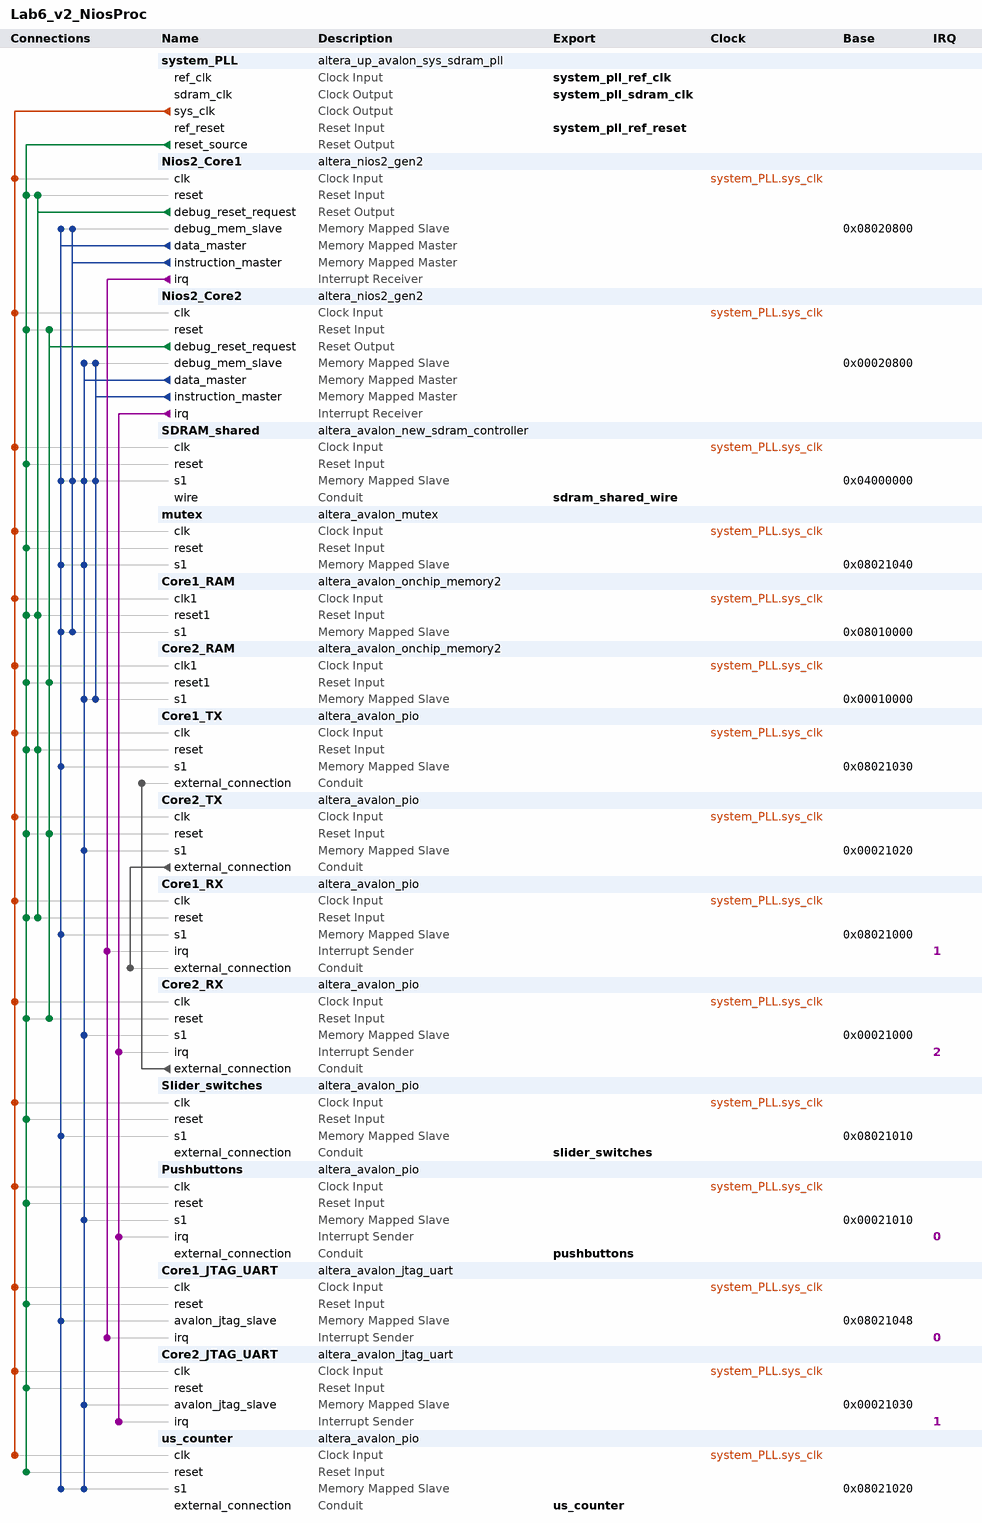
[diagram p0: system contents]
# Platform Designer (Qsys) system Lab6_v2_NiosProc, MAX 10 10M50DAF484C7G
# Parameters at their usual value, and those the tool derives, are not listed.
package require -exact qsys 18.1
create_system Lab6_v2_NiosProc
set_project_property DEVICE_FAMILY {MAX 10}
set_project_property DEVICE 10M50DAF484C7G

add_instance system_PLL altera_up_avalon_sys_sdram_pll 18.0
set_instance_parameter_value system_PLL CV_boards DE10-Standard
set_instance_parameter_value system_PLL gui_outclk 50.0
set_instance_parameter_value system_PLL gui_refclk 50.0

add_instance Nios2_Core1 altera_nios2_gen2 18.1
set_instance_parameter_value Nios2_Core1 dcache_size 2048
set_instance_parameter_value Nios2_Core1 exceptionSlave Core1_RAM.s1
set_instance_parameter_value Nios2_Core1 icache_size 4096
set_instance_parameter_value Nios2_Core1 impl Fast
set_instance_parameter_value Nios2_Core1 io_regionbase 134352896
set_instance_parameter_value Nios2_Core1 io_regionsize 4096
set_instance_parameter_value Nios2_Core1 resetSlave Core1_RAM.s1

add_instance Nios2_Core2 altera_nios2_gen2 18.1
set_instance_parameter_value Nios2_Core2 cpuID 1
set_instance_parameter_value Nios2_Core2 dcache_size 2048
set_instance_parameter_value Nios2_Core2 exceptionSlave Core2_RAM.s1
set_instance_parameter_value Nios2_Core2 icache_size 4096
set_instance_parameter_value Nios2_Core2 impl Fast
set_instance_parameter_value Nios2_Core2 io_regionbase 135168
set_instance_parameter_value Nios2_Core2 io_regionsize 4096
set_instance_parameter_value Nios2_Core2 resetSlave Core2_RAM.s1

add_instance SDRAM_shared altera_avalon_new_sdram_controller 18.1
set_instance_parameter_value SDRAM_shared TAC 5.5
set_instance_parameter_value SDRAM_shared TRCD 20.0
set_instance_parameter_value SDRAM_shared TRP 20.0
set_instance_parameter_value SDRAM_shared casLatency 3
set_instance_parameter_value SDRAM_shared columnWidth 10
set_instance_parameter_value SDRAM_shared dataWidth 16
set_instance_parameter_value SDRAM_shared generateSimulationModel false
set_instance_parameter_value SDRAM_shared model single_Micron_MT48LC4M32B2_7_chip
set_instance_parameter_value SDRAM_shared numberOfBanks 4
set_instance_parameter_value SDRAM_shared numberOfChipSelects 1
set_instance_parameter_value SDRAM_shared powerUpDelay 100.0
set_instance_parameter_value SDRAM_shared refreshPeriod 15.625
set_instance_parameter_value SDRAM_shared rowWidth 13

add_instance mutex altera_avalon_mutex 18.1

add_instance Core1_RAM altera_avalon_onchip_memory2 18.1
set_instance_parameter_value Core1_RAM dataWidth 32
set_instance_parameter_value Core1_RAM dualPort false
set_instance_parameter_value Core1_RAM initMemContent true
set_instance_parameter_value Core1_RAM initializationFileName onchip_mem.hex
set_instance_parameter_value Core1_RAM memorySize 65536

add_instance Core2_RAM altera_avalon_onchip_memory2 18.1
set_instance_parameter_value Core2_RAM dataWidth 32
set_instance_parameter_value Core2_RAM dualPort false
set_instance_parameter_value Core2_RAM initMemContent true
set_instance_parameter_value Core2_RAM initializationFileName onchip_mem.hex
set_instance_parameter_value Core2_RAM memorySize 65536

add_instance Core1_TX altera_avalon_pio 18.1
set_instance_parameter_value Core1_TX direction Output
set_instance_parameter_value Core1_TX width 1

add_instance Core2_TX altera_avalon_pio 18.1
set_instance_parameter_value Core2_TX direction Output
set_instance_parameter_value Core2_TX width 1

add_instance Core1_RX altera_avalon_pio 18.1
set_instance_parameter_value Core1_RX captureEdge true
set_instance_parameter_value Core1_RX direction Input
set_instance_parameter_value Core1_RX generateIRQ true
set_instance_parameter_value Core1_RX irqType EDGE
set_instance_parameter_value Core1_RX width 1

add_instance Core2_RX altera_avalon_pio 18.1
set_instance_parameter_value Core2_RX captureEdge true
set_instance_parameter_value Core2_RX direction Input
set_instance_parameter_value Core2_RX generateIRQ true
set_instance_parameter_value Core2_RX irqType EDGE
set_instance_parameter_value Core2_RX width 1

add_instance Slider_switches altera_avalon_pio 18.1
set_instance_parameter_value Slider_switches direction Input
set_instance_parameter_value Slider_switches width 10

add_instance Pushbuttons altera_avalon_pio 18.1
set_instance_parameter_value Pushbuttons captureEdge true
set_instance_parameter_value Pushbuttons direction Input
set_instance_parameter_value Pushbuttons generateIRQ true
set_instance_parameter_value Pushbuttons irqType EDGE
set_instance_parameter_value Pushbuttons width 2

add_instance Core1_JTAG_UART altera_avalon_jtag_uart 18.1
set_instance_parameter_value Core1_JTAG_UART simInteractiveOptions NO_INTERACTIVE_WINDOWS

add_instance Core2_JTAG_UART altera_avalon_jtag_uart 18.1
set_instance_parameter_value Core2_JTAG_UART simInteractiveOptions NO_INTERACTIVE_WINDOWS

add_instance us_counter altera_avalon_pio 18.1
set_instance_parameter_value us_counter direction Input
set_instance_parameter_value us_counter width 32

# connections
add_connection system_PLL.sys_clk Core1_JTAG_UART.clk clock
add_connection system_PLL.sys_clk Core1_RAM.clk1 clock
add_connection system_PLL.sys_clk Core1_RX.clk clock
add_connection system_PLL.sys_clk Core1_TX.clk clock
add_connection system_PLL.sys_clk Core2_JTAG_UART.clk clock
add_connection system_PLL.sys_clk Core2_RAM.clk1 clock
add_connection system_PLL.sys_clk Core2_RX.clk clock
add_connection system_PLL.sys_clk Core2_TX.clk clock
add_connection system_PLL.sys_clk mutex.clk clock
add_connection system_PLL.sys_clk Nios2_Core1.clk clock
add_connection system_PLL.sys_clk Nios2_Core2.clk clock
add_connection system_PLL.sys_clk Pushbuttons.clk clock
add_connection system_PLL.sys_clk SDRAM_shared.clk clock
add_connection system_PLL.sys_clk Slider_switches.clk clock
add_connection system_PLL.sys_clk us_counter.clk clock
add_connection Nios2_Core1.debug_reset_request Core1_RAM.reset1 reset
add_connection Nios2_Core1.debug_reset_request Core1_RX.reset reset
add_connection Nios2_Core1.debug_reset_request Core1_TX.reset reset
add_connection Nios2_Core1.debug_reset_request Nios2_Core1.reset reset
add_connection Nios2_Core2.debug_reset_request Core2_RAM.reset1 reset
add_connection Nios2_Core2.debug_reset_request Core2_RX.reset reset
add_connection Nios2_Core2.debug_reset_request Core2_TX.reset reset
add_connection Nios2_Core2.debug_reset_request Nios2_Core2.reset reset
add_connection system_PLL.reset_source Core1_JTAG_UART.reset reset
add_connection system_PLL.reset_source Core1_RAM.reset1 reset
add_connection system_PLL.reset_source Core1_RX.reset reset
add_connection system_PLL.reset_source Core1_TX.reset reset
add_connection system_PLL.reset_source Core2_JTAG_UART.reset reset
add_connection system_PLL.reset_source Core2_RAM.reset1 reset
add_connection system_PLL.reset_source Core2_RX.reset reset
add_connection system_PLL.reset_source Core2_TX.reset reset
add_connection system_PLL.reset_source mutex.reset reset
add_connection system_PLL.reset_source Nios2_Core1.reset reset
add_connection system_PLL.reset_source Nios2_Core2.reset reset
add_connection system_PLL.reset_source Pushbuttons.reset reset
add_connection system_PLL.reset_source SDRAM_shared.reset reset
add_connection system_PLL.reset_source Slider_switches.reset reset
add_connection system_PLL.reset_source us_counter.reset reset
add_connection Nios2_Core1.data_master Core1_JTAG_UART.avalon_jtag_slave avalon
set_connection_parameter_value Nios2_Core1.data_master/Core1_JTAG_UART.avalon_jtag_slave baseAddress 0x08021048
add_connection Nios2_Core1.data_master Core1_RAM.s1 avalon
set_connection_parameter_value Nios2_Core1.data_master/Core1_RAM.s1 baseAddress 0x08010000
add_connection Nios2_Core1.data_master Core1_RX.s1 avalon
set_connection_parameter_value Nios2_Core1.data_master/Core1_RX.s1 baseAddress 0x08021000
add_connection Nios2_Core1.data_master Core1_TX.s1 avalon
set_connection_parameter_value Nios2_Core1.data_master/Core1_TX.s1 baseAddress 0x08021030
add_connection Nios2_Core1.data_master mutex.s1 avalon
set_connection_parameter_value Nios2_Core1.data_master/mutex.s1 baseAddress 0x08021040
add_connection Nios2_Core1.data_master Nios2_Core1.debug_mem_slave avalon
set_connection_parameter_value Nios2_Core1.data_master/Nios2_Core1.debug_mem_slave baseAddress 0x08020800
add_connection Nios2_Core1.data_master SDRAM_shared.s1 avalon
set_connection_parameter_value Nios2_Core1.data_master/SDRAM_shared.s1 baseAddress 0x04000000
add_connection Nios2_Core1.data_master Slider_switches.s1 avalon
set_connection_parameter_value Nios2_Core1.data_master/Slider_switches.s1 baseAddress 0x08021010
add_connection Nios2_Core1.data_master us_counter.s1 avalon
set_connection_parameter_value Nios2_Core1.data_master/us_counter.s1 baseAddress 0x08021020
add_connection Nios2_Core1.instruction_master Core1_RAM.s1 avalon
set_connection_parameter_value Nios2_Core1.instruction_master/Core1_RAM.s1 baseAddress 0x08010000
add_connection Nios2_Core1.instruction_master Nios2_Core1.debug_mem_slave avalon
set_connection_parameter_value Nios2_Core1.instruction_master/Nios2_Core1.debug_mem_slave baseAddress 0x08020800
add_connection Nios2_Core1.instruction_master SDRAM_shared.s1 avalon
set_connection_parameter_value Nios2_Core1.instruction_master/SDRAM_shared.s1 baseAddress 0x04000000
add_connection Nios2_Core2.data_master Core2_JTAG_UART.avalon_jtag_slave avalon
set_connection_parameter_value Nios2_Core2.data_master/Core2_JTAG_UART.avalon_jtag_slave baseAddress 0x00021030
add_connection Nios2_Core2.data_master Core2_RAM.s1 avalon
set_connection_parameter_value Nios2_Core2.data_master/Core2_RAM.s1 baseAddress 0x00010000
add_connection Nios2_Core2.data_master Core2_RX.s1 avalon
set_connection_parameter_value Nios2_Core2.data_master/Core2_RX.s1 baseAddress 0x00021000
add_connection Nios2_Core2.data_master Core2_TX.s1 avalon
set_connection_parameter_value Nios2_Core2.data_master/Core2_TX.s1 baseAddress 0x00021020
add_connection Nios2_Core2.data_master mutex.s1 avalon
set_connection_parameter_value Nios2_Core2.data_master/mutex.s1 baseAddress 0x08021040
add_connection Nios2_Core2.data_master Nios2_Core2.debug_mem_slave avalon
set_connection_parameter_value Nios2_Core2.data_master/Nios2_Core2.debug_mem_slave baseAddress 0x00020800
add_connection Nios2_Core2.data_master Pushbuttons.s1 avalon
set_connection_parameter_value Nios2_Core2.data_master/Pushbuttons.s1 baseAddress 0x00021010
add_connection Nios2_Core2.data_master SDRAM_shared.s1 avalon
set_connection_parameter_value Nios2_Core2.data_master/SDRAM_shared.s1 baseAddress 0x04000000
add_connection Nios2_Core2.data_master us_counter.s1 avalon
set_connection_parameter_value Nios2_Core2.data_master/us_counter.s1 baseAddress 0x08021020
add_connection Nios2_Core2.instruction_master Core2_RAM.s1 avalon
set_connection_parameter_value Nios2_Core2.instruction_master/Core2_RAM.s1 baseAddress 0x00010000
add_connection Nios2_Core2.instruction_master Nios2_Core2.debug_mem_slave avalon
set_connection_parameter_value Nios2_Core2.instruction_master/Nios2_Core2.debug_mem_slave baseAddress 0x00020800
add_connection Nios2_Core2.instruction_master SDRAM_shared.s1 avalon
set_connection_parameter_value Nios2_Core2.instruction_master/SDRAM_shared.s1 baseAddress 0x04000000
add_connection Core2_RX.external_connection Core1_TX.external_connection conduit
add_connection Core2_TX.external_connection Core1_RX.external_connection conduit
add_connection Nios2_Core1.irq Core1_JTAG_UART.irq interrupt
set_connection_parameter_value Nios2_Core1.irq/Core1_JTAG_UART.irq irqNumber 0
add_connection Nios2_Core1.irq Core1_RX.irq interrupt
set_connection_parameter_value Nios2_Core1.irq/Core1_RX.irq irqNumber 1
add_connection Nios2_Core2.irq Core2_JTAG_UART.irq interrupt
set_connection_parameter_value Nios2_Core2.irq/Core2_JTAG_UART.irq irqNumber 1
add_connection Nios2_Core2.irq Core2_RX.irq interrupt
set_connection_parameter_value Nios2_Core2.irq/Core2_RX.irq irqNumber 2
add_connection Nios2_Core2.irq Pushbuttons.irq interrupt
set_connection_parameter_value Nios2_Core2.irq/Pushbuttons.irq irqNumber 0

# exported interfaces
add_interface pushbuttons conduit end
set_interface_property pushbuttons EXPORT_OF Pushbuttons.external_connection
add_interface sdram_shared_wire conduit end
set_interface_property sdram_shared_wire EXPORT_OF SDRAM_shared.wire
add_interface slider_switches conduit end
set_interface_property slider_switches EXPORT_OF Slider_switches.external_connection
add_interface system_pll_ref_clk clock sink
set_interface_property system_pll_ref_clk EXPORT_OF system_PLL.ref_clk
add_interface system_pll_ref_reset reset sink
set_interface_property system_pll_ref_reset EXPORT_OF system_PLL.ref_reset
add_interface system_pll_sdram_clk clock source
set_interface_property system_pll_sdram_clk EXPORT_OF system_PLL.sdram_clk
add_interface us_counter conduit end
set_interface_property us_counter EXPORT_OF us_counter.external_connection

set_interconnect_requirement {$system} qsys_mm.clockCrossingAdapter HANDSHAKE
set_interconnect_requirement {$system} qsys_mm.enableEccProtection FALSE
set_interconnect_requirement {$system} qsys_mm.insertDefaultSlave FALSE
set_interconnect_requirement {$system} qsys_mm.maxAdditionalLatency 1

save_system Lab6_v2_NiosProc.qsys
